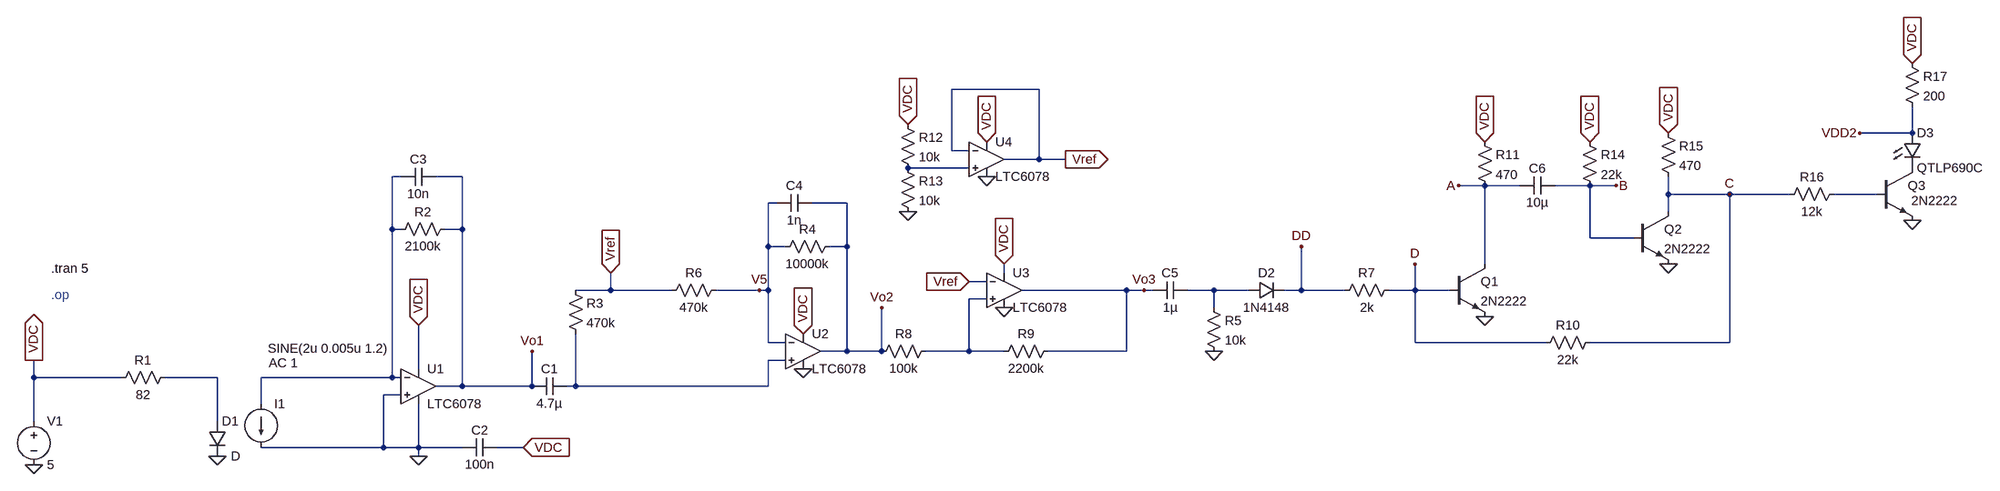
[diagram p0: schematic PPG_heart_rate_sensor_Sim.asc]
PPG_heart_rate_sensor_Sim.asc, the LTspice schematic file:
Version 4.1
SHEET 1 5028 708
WIRE 3296 -1952 3136 -1952
WIRE 4896 -1872 4896 -1920
WIRE 4896 -1872 4800 -1872
WIRE 3136 -1840 3136 -1952
WIRE 3168 -1840 3136 -1840
WIRE 3296 -1824 3296 -1952
WIRE 3296 -1824 3232 -1824
WIRE 3344 -1824 3296 -1824
WIRE 3168 -1808 3056 -1808
WIRE 2128 -1792 2112 -1792
WIRE 2240 -1792 2192 -1792
WIRE 4112 -1776 4064 -1776
WIRE 4176 -1776 4112 -1776
WIRE 4304 -1776 4240 -1776
WIRE 4352 -1776 4304 -1776
WIRE 4448 -1760 4448 -1792
WIRE 4560 -1760 4448 -1760
WIRE 4672 -1760 4560 -1760
WIRE 4832 -1760 4752 -1760
WIRE 2816 -1744 2800 -1744
WIRE 2944 -1744 2880 -1744
WIRE 4448 -1728 4448 -1760
WIRE 2112 -1696 2112 -1792
WIRE 2128 -1696 2112 -1696
WIRE 2240 -1696 2240 -1792
WIRE 2240 -1696 2208 -1696
WIRE 4304 -1680 4304 -1776
WIRE 4384 -1680 4304 -1680
WIRE 2800 -1664 2800 -1744
WIRE 2832 -1664 2800 -1664
WIRE 2944 -1664 2944 -1744
WIRE 2944 -1664 2912 -1664
WIRE 4112 -1632 4112 -1776
WIRE 3232 -1616 3232 -1632
WIRE 3200 -1600 3168 -1600
WIRE 2512 -1584 2512 -1616
WIRE 2512 -1584 2448 -1584
WIRE 2624 -1584 2512 -1584
WIRE 2784 -1584 2704 -1584
WIRE 2800 -1584 2800 -1664
WIRE 2800 -1584 2784 -1584
WIRE 3456 -1584 3264 -1584
WIRE 3488 -1584 3456 -1584
WIRE 3504 -1584 3488 -1584
WIRE 3616 -1584 3568 -1584
WIRE 3680 -1584 3616 -1584
WIRE 3776 -1584 3776 -1664
WIRE 3776 -1584 3744 -1584
WIRE 3856 -1584 3776 -1584
WIRE 3984 -1584 3984 -1632
WIRE 3984 -1584 3936 -1584
WIRE 4048 -1584 3984 -1584
WIRE 3200 -1568 3168 -1568
WIRE 3616 -1552 3616 -1584
WIRE 2800 -1488 2800 -1584
WIRE 2832 -1488 2800 -1488
WIRE 3984 -1488 3984 -1584
WIRE 4224 -1488 3984 -1488
WIRE 4560 -1488 4560 -1760
WIRE 4560 -1488 4304 -1488
WIRE 2944 -1472 2944 -1664
WIRE 2944 -1472 2896 -1472
WIRE 3008 -1472 3008 -1552
WIRE 3008 -1472 2944 -1472
WIRE 3168 -1472 3168 -1568
WIRE 3168 -1472 3088 -1472
WIRE 3232 -1472 3168 -1472
WIRE 3456 -1472 3456 -1584
WIRE 3456 -1472 3312 -1472
WIRE 2832 -1456 2800 -1456
WIRE 2160 -1440 2160 -1520
WIRE 1456 -1424 1456 -1456
WIRE 1616 -1424 1456 -1424
WIRE 1792 -1424 1696 -1424
WIRE 2112 -1424 2112 -1696
WIRE 2112 -1424 1872 -1424
WIRE 2128 -1424 2112 -1424
WIRE 2240 -1408 2240 -1696
WIRE 2240 -1408 2192 -1408
WIRE 2368 -1408 2368 -1472
WIRE 2368 -1408 2240 -1408
WIRE 2448 -1408 2448 -1504
WIRE 2448 -1408 2432 -1408
WIRE 2800 -1408 2800 -1456
WIRE 2800 -1408 2448 -1408
WIRE 2128 -1392 2096 -1392
WIRE 1872 -1376 1872 -1424
WIRE 1456 -1344 1456 -1424
WIRE 1792 -1344 1792 -1424
WIRE 2096 -1296 2096 -1392
WIRE 2096 -1296 1872 -1296
WIRE 2160 -1296 2160 -1376
WIRE 2160 -1296 2096 -1296
WIRE 2240 -1296 2160 -1296
WIRE 2352 -1296 2304 -1296
WIRE 2160 -1280 2160 -1296
FLAG 1456 -1264 0
FLAG 2160 -1280 0
FLAG 1792 -1280 0
FLAG 2864 -1440 0
FLAG 2784 -1584 V5
FLAG 3232 -1552 0
FLAG 1456 -1456 VDC
IOPIN 1456 -1456 Out
FLAG 2352 -1296 VDC
IOPIN 2352 -1296 In
FLAG 2160 -1520 VDC
IOPIN 2160 -1520 In
FLAG 3232 -1632 VDC
IOPIN 3232 -1632 In
FLAG 2864 -1504 VDC
IOPIN 2864 -1504 In
FLAG 2368 -1472 Vo1
FLAG 3200 -1792 0
FLAG 3056 -1888 VDC
IOPIN 3056 -1888 In
FLAG 3200 -1856 VDC
IOPIN 3200 -1856 In
FLAG 3056 -1728 0
FLAG 3344 -1824 Vref
IOPIN 3344 -1824 Out
FLAG 2512 -1616 Vref
IOPIN 2512 -1616 In
FLAG 3008 -1552 Vo2
FLAG 3168 -1600 Vref
IOPIN 3168 -1600 In
FLAG 3488 -1584 Vo3
FLAG 3616 -1472 0
FLAG 3776 -1664 DD
FLAG 3984 -1632 D
FLAG 4112 -1856 VDC
IOPIN 4112 -1856 In
FLAG 4304 -1856 VDC
IOPIN 4304 -1856 In
FLAG 4112 -1536 0
FLAG 4064 -1776 A
FLAG 4352 -1776 B
FLAG 4448 -1872 VDC
IOPIN 4448 -1872 In
FLAG 4448 -1632 0
FLAG 4896 -1712 0
FLAG 4896 -2000 VDC
IOPIN 4896 -2000 In
FLAG 4800 -1872 VDD2
FLAG 4560 -1760 C
SYMBOL voltage 1456 -1360 R0
WINDOW 123 0 0 Left 0
WINDOW 39 0 0 Left 0
SYMATTR InstName V1
SYMATTR Value 5
SYMBOL res 1712 -1440 R90
WINDOW 0 0 56 VBottom 2
WINDOW 3 32 56 VTop 2
SYMATTR InstName R1
SYMATTR Value 82
SYMBOL diode 1776 -1344 R0
WINDOW 3 41 64 Left 2
SYMATTR InstName D1
SYMBOL current 1872 -1376 R0
WINDOW 123 14 -75 Left 2
WINDOW 39 0 0 Left 0
WINDOW 3 12 -101 Left 2
SYMATTR Value2 AC 1
SYMATTR Value SINE(2u 0.005u 1.2)
SYMATTR InstName I1
SYMBOL OpAmps\\LTC6078 2160 -1408 R0
SYMATTR InstName U1
SYMBOL cap 2304 -1312 R90
WINDOW 0 0 32 VBottom 2
WINDOW 3 32 32 VTop 2
SYMATTR InstName C2
SYMATTR Value 100n
SYMBOL cap 2128 -1776 R270
WINDOW 0 32 32 VTop 2
WINDOW 3 0 32 VBottom 2
SYMATTR InstName C3
SYMATTR Value 10n
SYMBOL cap 2432 -1424 R90
WINDOW 0 0 32 VBottom 2
WINDOW 3 32 32 VTop 2
SYMATTR InstName C1
SYMATTR Value 4.7µ
SYMBOL res 2432 -1600 R0
SYMATTR InstName R3
SYMATTR Value 470k
SYMBOL res 2224 -1712 R90
WINDOW 0 0 56 VBottom 2
WINDOW 3 32 56 VTop 2
SYMATTR InstName R2
SYMATTR Value 2100k
SYMBOL res 2720 -1600 R90
WINDOW 0 0 56 VBottom 2
WINDOW 3 32 56 VTop 2
SYMATTR InstName R6
SYMATTR Value 470k
SYMBOL OpAmps\\LTC6078 2864 -1472 R0
SYMATTR InstName U2
SYMBOL res 3104 -1488 R90
WINDOW 0 0 56 VBottom 2
WINDOW 3 32 56 VTop 2
SYMATTR InstName R8
SYMATTR Value 100k
SYMBOL res 3328 -1488 R90
WINDOW 0 0 56 VBottom 2
WINDOW 3 32 56 VTop 2
SYMATTR InstName R9
SYMATTR Value 2200k
SYMBOL OpAmps\\LTC6078 3232 -1584 R0
SYMATTR InstName U3
SYMBOL res 3040 -1904 R0
SYMATTR InstName R12
SYMATTR Value 10k
SYMBOL res 3040 -1824 R0
SYMATTR InstName R13
SYMATTR Value 10k
SYMBOL OpAmps\\LTC6078 3200 -1824 R0
SYMATTR InstName U4
SYMBOL cap 2880 -1760 R90
WINDOW 0 0 32 VBottom 2
WINDOW 3 32 32 VTop 2
SYMATTR InstName C4
SYMATTR Value 1n
SYMBOL res 2928 -1680 R90
WINDOW 0 0 56 VBottom 2
WINDOW 3 32 56 VTop 2
SYMATTR InstName R4
SYMATTR Value 10000k
SYMBOL cap 3568 -1600 R90
WINDOW 0 0 32 VBottom 2
WINDOW 3 32 32 VTop 2
SYMATTR InstName C5
SYMATTR Value 1µ
SYMBOL res 3600 -1568 R0
SYMATTR InstName R5
SYMATTR Value 10k
SYMBOL diode 3680 -1568 R270
WINDOW 0 32 32 VTop 2
WINDOW 3 0 32 VBottom 2
SYMATTR InstName D2
SYMATTR Value 1N4148
SYMBOL res 3952 -1600 R90
WINDOW 0 0 56 VBottom 2
WINDOW 3 32 56 VTop 2
SYMATTR InstName R7
SYMATTR Value 2k
SYMBOL npn 4048 -1632 R0
SYMATTR InstName Q1
SYMATTR Value 2N2222
SYMBOL npn 4384 -1728 R0
SYMATTR InstName Q2
SYMATTR Value 2N2222
SYMBOL npn 4832 -1808 R0
WINDOW 3 62 60 Left 2
SYMATTR Value 2N2222
SYMATTR InstName Q3
SYMBOL res 4320 -1504 R90
WINDOW 0 0 56 VBottom 2
WINDOW 3 32 56 VTop 2
SYMATTR InstName R10
SYMATTR Value 22k
SYMBOL res 4096 -1872 R0
SYMATTR InstName R11
SYMATTR Value 470
SYMBOL res 4288 -1872 R0
SYMATTR InstName R14
SYMATTR Value 22k
SYMBOL cap 4240 -1792 R90
WINDOW 0 0 32 VBottom 2
WINDOW 3 32 32 VTop 2
SYMATTR InstName C6
SYMATTR Value 10µ
SYMBOL res 4432 -1888 R0
SYMATTR InstName R15
SYMATTR Value 470
SYMBOL res 4768 -1776 R90
WINDOW 0 0 56 VBottom 2
WINDOW 3 32 56 VTop 2
SYMATTR InstName R16
SYMATTR Value 12k
SYMBOL LED 4880 -1872 R0
SYMATTR InstName D3
SYMATTR Value QTLP690C
SYMATTR Description Diode
SYMATTR Type diode
SYMBOL res 4880 -2016 R0
SYMATTR InstName R17
SYMATTR Value 200
TEXT 1488 -1624 Left 2 !.tran 5
TEXT 1488 -1576 Left 2 ;.op

The netlist it stands for:
* PPG_heart_rate_sensor_Sim.asc
V1 VDC 0 5
R1 N007 VDC 82
D1 N007 0 D
I1 N002 0 SINE(2u 0.005u 1.2) AC 1
X§U1 0 N002 VDC 0 Vo1 LTC6078  ; pins IN+ IN- VCC VEE OUT
C2 VDC 0 100n
C3 N002 Vo1 10n
C1 N006 Vo1 4.7µ
R3 Vref N006 470k
R2 Vo1 N002 2100k
R6 V5 Vref 470k
X§U2 N006 V5 VDC 0 Vo2 LTC6078  ; pins IN+ IN- VCC VEE OUT
R8 N005 Vo2 100k
R9 Vo3 N005 2200k
X§U3 N005 Vref VDC 0 Vo3 LTC6078  ; pins IN+ IN- VCC VEE OUT
R12 VDC N001 10k
R13 N001 0 10k
X§U4 N001 Vref VDC 0 Vref LTC6078  ; pins IN+ IN- VCC VEE OUT
C4 Vo2 V5 1n
R4 Vo2 V5 10000k
C5 N004 Vo3 1µ
R5 N004 0 10k
D2 N004 DD 1N4148
R7 D DD 2k
Q1 A D 0 0 2N2222
Q2 C B 0 0 2N2222
Q3 P001 N003 0 0 2N2222
R10 C D 22k
R11 VDC A 470
R14 VDC B 22k
C6 B A 10µ
R15 VDC C 470
R16 N003 C 12k
D3 VDD2 P001 QTLP690C
R17 VDC VDD2 200
.model D D
.lib standard.dio
.model NPN NPN
.model PNP PNP
.lib standard.bjt
.tran 5
* .op
.lib LTC5.lib
.backanno
.end